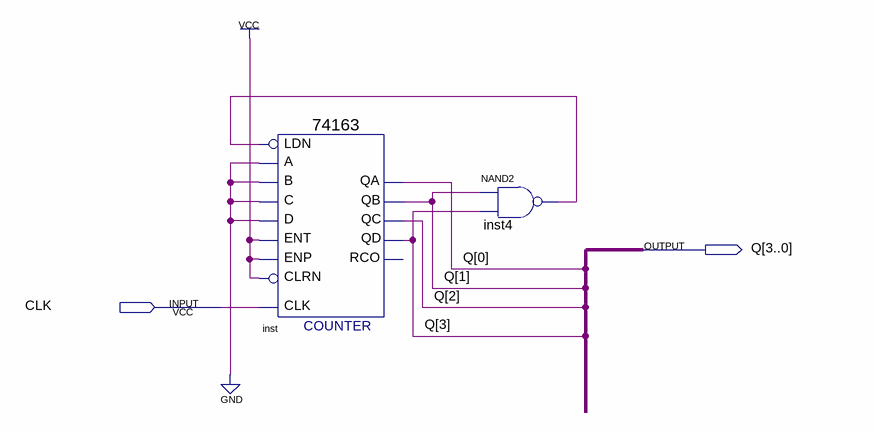
[diagram p0: schematic sheet]
// Quartus schematic SpecialCount.bdf as structural Verilog: 2 symbols, 2 pins
module SpecialCount (
  input  CLK,
  output [3:0] Q
);

  wire inst4_out;

  \74163  inst (
    .C(1'b0), .B(1'b0), .A(1'b0), .ENT(1'b1), .D(1'b0), .CLRN(1'b1), .CLK(CLK), .ENP(1'b1), .LDN(inst4_out),
    .QA(Q[0]), .QB(Q[1]), .QC(Q[2]), .QD(Q[3]));  // open: RCO
  nand inst4 (inst4_out, Q[1], Q[3]);
endmodule
